# Altium schematic sheet POWER.schdoc
size 521 x 279 mm
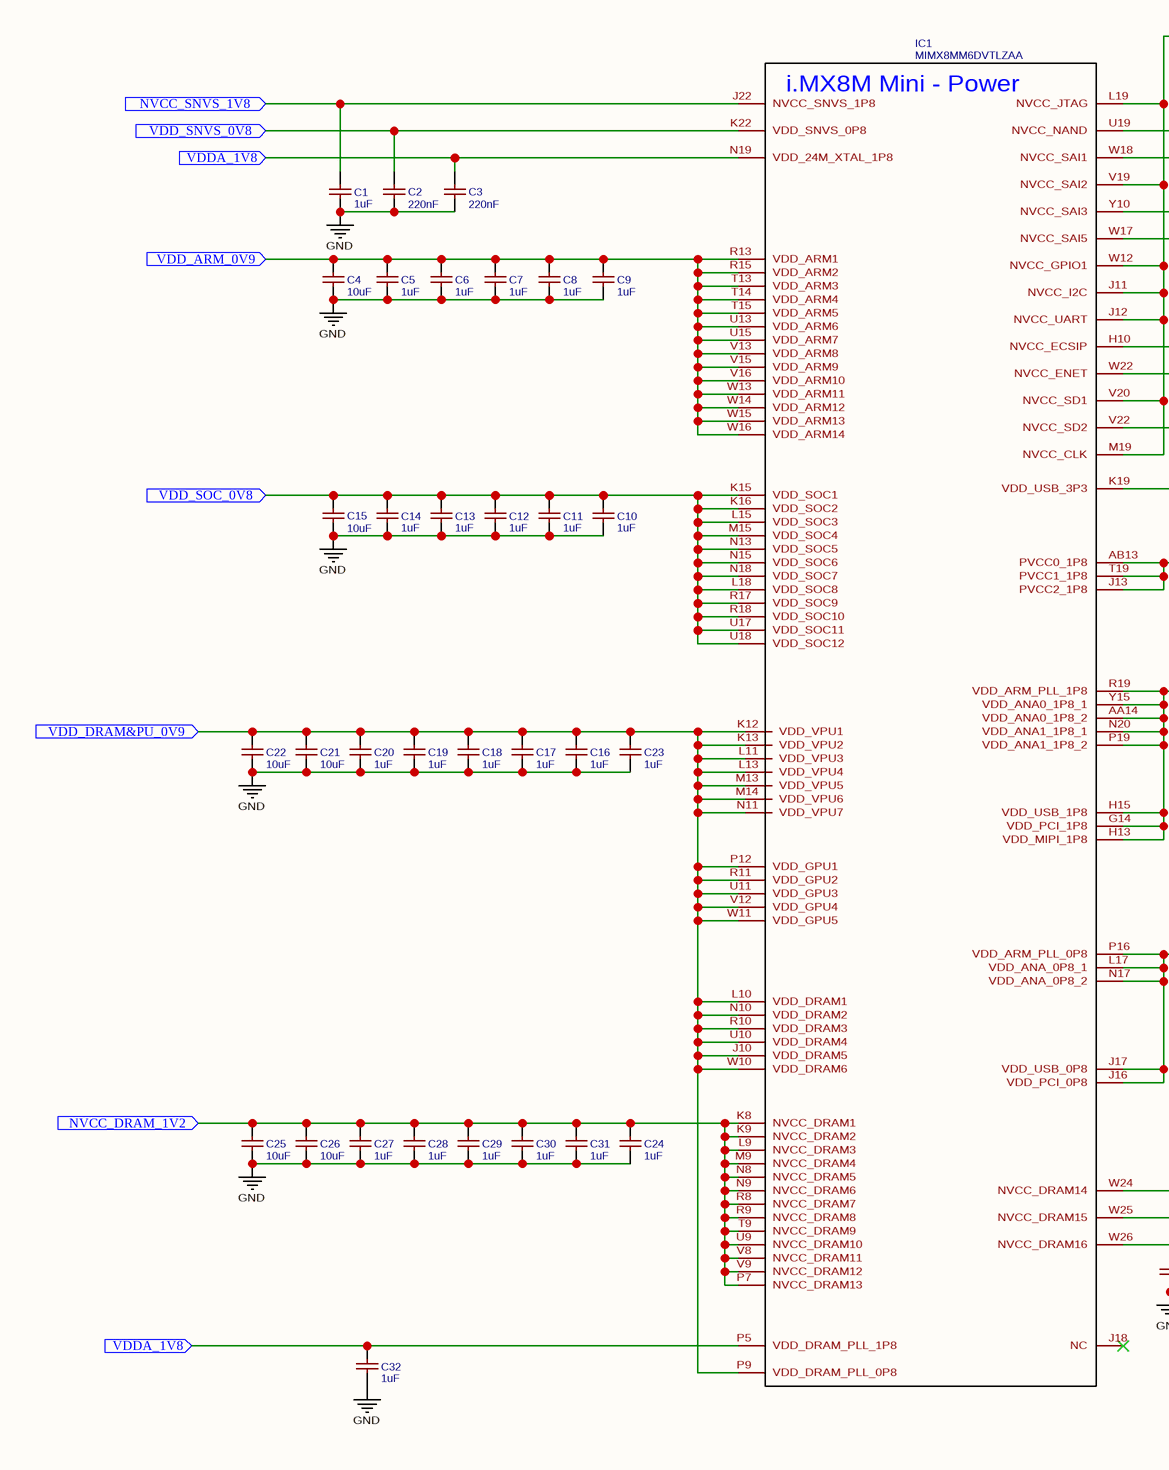
[diagram p0: POWER.schdoc, left]
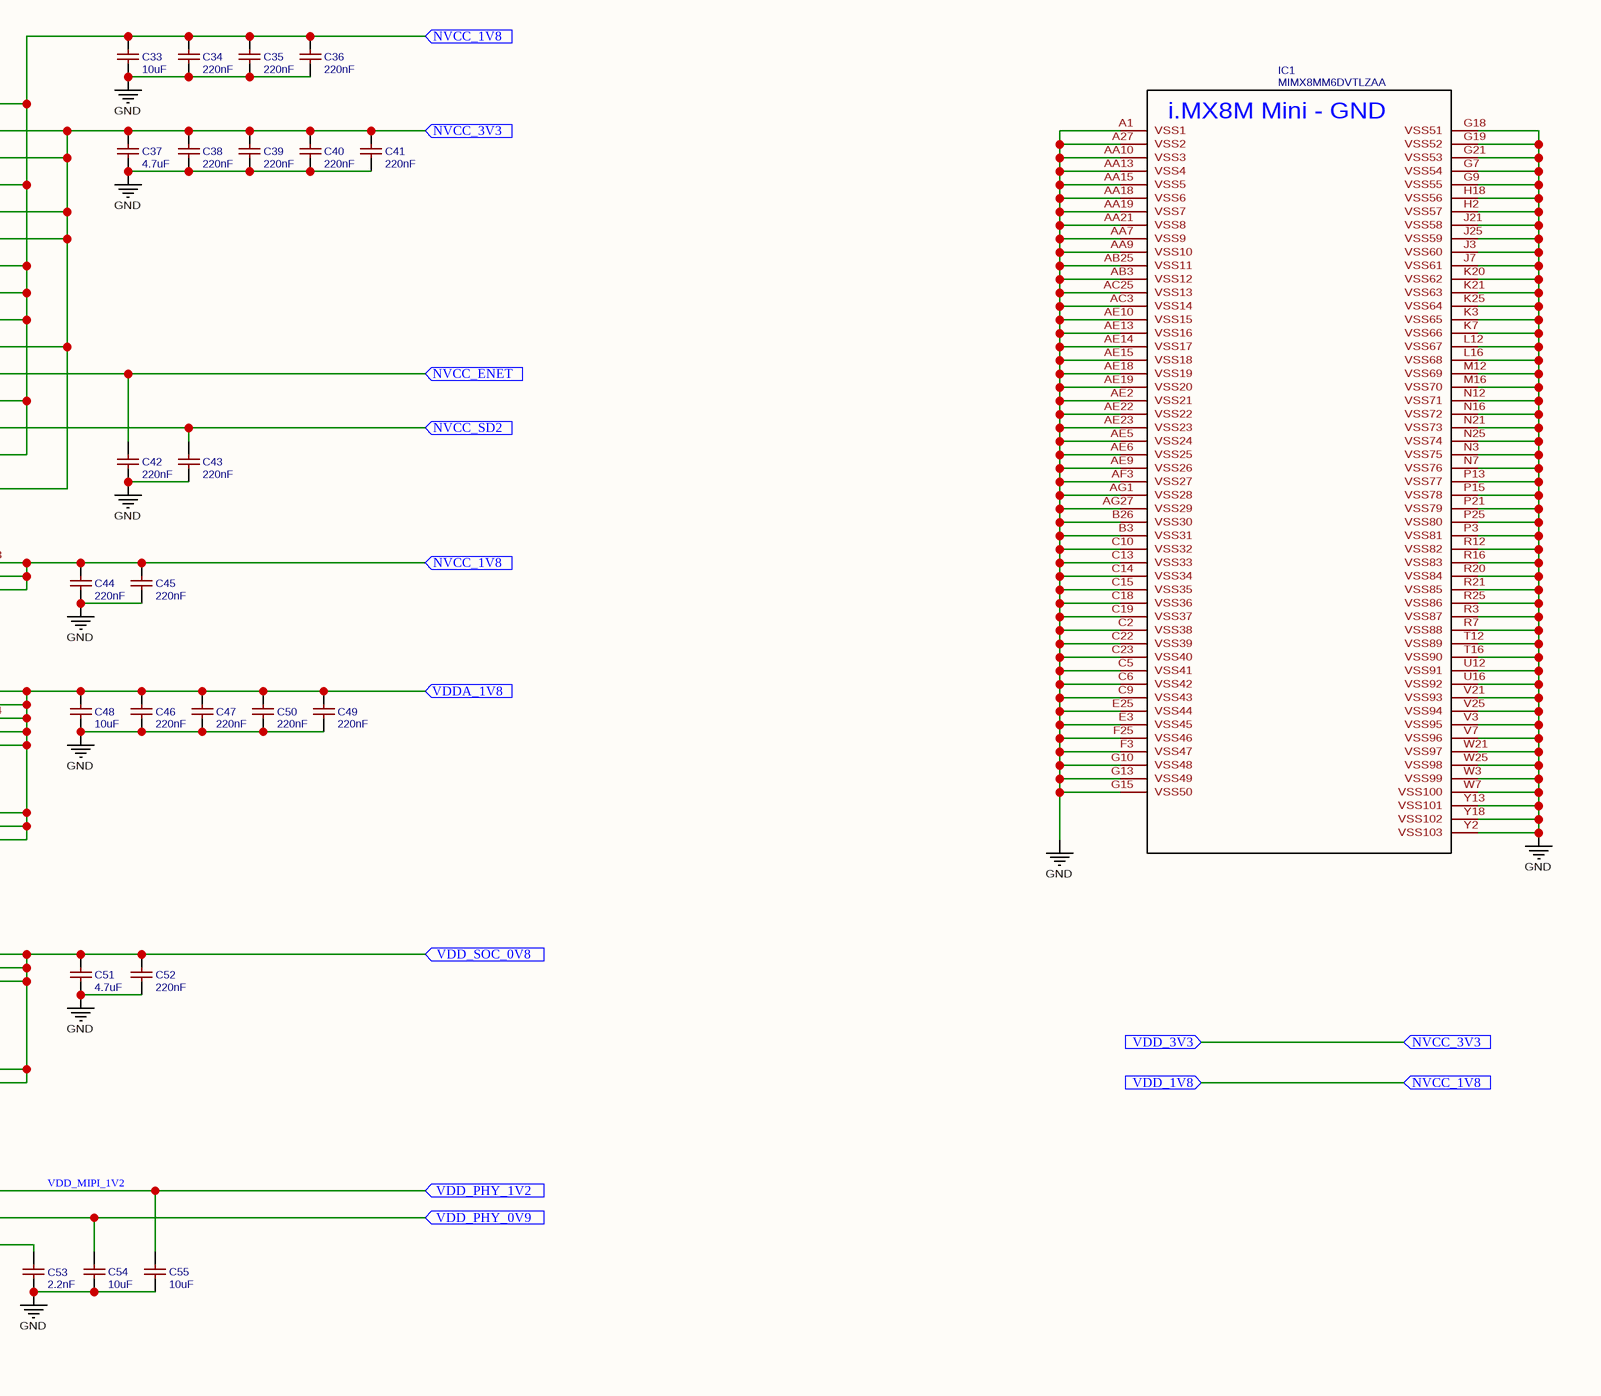
[diagram p1: POWER.schdoc, right]

## Parts
(Parts that share a designator on the sheet are numbered #1, #2 ... from top to bottom, then left to right.)
C1  1uF  [C0603]
C2  220nF  [C0805]
C3  220nF  [C0805]
C4  10uF  [C0402]
C5  1uF  [C0603]
C6  1uF  [C0603]
C7  1uF  [C0603]
C8  1uF  [C0603]
C9  1uF  [C0603]
C10  1uF  [C0603]
C11  1uF  [C0603]
C12  1uF  [C0603]
C13  1uF  [C0603]
C14  1uF  [C0603]
C15  10uF  [C0402]
C16  1uF  [C0603]
C17  1uF  [C0603]
C18  1uF  [C0603]
C19  1uF  [C0603]
C20  1uF  [C0603]
C21  10uF  [C0402]
C22  10uF  [C0402]
C23  1uF  [C0603]
C24  1uF  [C0603]
C25  10uF  [C0402]
C26  10uF  [C0402]
C27  1uF  [C0603]
C28  1uF  [C0603]
C29  1uF  [C0603]
C30  1uF  [C0603]
C31  1uF  [C0603]
C32  1uF  [C0603]
C33  10uF  [C0402]
C34  220nF  [C0805]
C35  220nF  [C0805]
C36  220nF  [C0805]
C37  4.7uF  [C0402]
C38  220nF  [C0805]
C39  220nF  [C0805]
C40  220nF  [C0805]
C41  220nF  [C0805]
C42  220nF  [C0805]
C43  220nF  [C0805]
C44  220nF  [C0805]
C45  220nF  [C0805]
C46  220nF  [C0805]
C47  220nF  [C0805]
C48  10uF  [C0402]
C49  220nF  [C0805]
C50  220nF  [C0805]
C51  4.7uF  [C0402]
C52  220nF  [C0805]
C53  2.2nF  [C0402]
C54  10uF  [C0402]
C55  10uF  [C0402]
IC1#1  MIMX8MM6DVTLZAA  [BGA486C50P27X27_1400X1400X125]
IC1#2  MIMX8MM6DVTLZAA  [BGA486C50P27X27_1400X1400X125]

## Ports
NVCC_1V8 (in), NVCC_3V3 (in), NVCC_DRAM_1V2 (in), NVCC_ENET (in), NVCC_SD2 (in), NVCC_SNVS_1V8 (in), VDD_1V8 (in), VDD_3V3 (in), VDD_ARM_0V9 (in), VDD_DRAM&PU_0V9 (in), VDD_PHY_0V9 (in), VDD_PHY_1V2 (in), VDD_SNVS_0V8 (in), VDD_SOC_0V8 (in), VDDA_1V8 (in)

## Nets
GND: C1.1 C2.1 C3.1 C4.1 C5.1 C6.1 C7.1 C8.1 C9.1 C10.1 C11.1 C12.1 C13.1 C14.1 C15.1 C16.1 C17.1 C18.1 C19.1 C20.1 C21.1 C22.1 C23.1 C24.1 C25.1 C26.1 C27.1 C28.1 C29.1 C30.1 C31.1 C32.1 C33.1 C34.1 C35.1 C36.1 C37.1 C38.1 C39.1 C40.1 C41.1 C42.1 C43.1 C44.1 C45.1 C46.1 C47.1 C48.1 C49.1 C50.1 C51.1 C52.1 C53.1 C54.1 C55.1 IC1#2.A1(VSS1) IC1#2.A27(VSS2) IC1#2.AA7(VSS9) IC1#2.AA9(VSS10) IC1#2.AA10(VSS3) IC1#2.AA13(VSS4) IC1#2.AA15(VSS5) IC1#2.AA18(VSS6) IC1#2.AA19(VSS7) IC1#2.AA21(VSS8) IC1#2.AB3(VSS12) IC1#2.AB25(VSS11) IC1#2.AC3(VSS14) IC1#2.AC25(VSS13) IC1#2.AE2(VSS21) IC1#2.AE5(VSS24) IC1#2.AE6(VSS25) IC1#2.AE9(VSS26) IC1#2.AE10(VSS15) IC1#2.AE13(VSS16) IC1#2.AE14(VSS17) IC1#2.AE15(VSS18) IC1#2.AE18(VSS19) IC1#2.AE19(VSS20) IC1#2.AE22(VSS22) IC1#2.AE23(VSS23) IC1#2.AF3(VSS27) IC1#2.AG1(VSS28) IC1#2.AG27(VSS29) IC1#2.B3(VSS31) IC1#2.B26(VSS30) IC1#2.C2(VSS38) IC1#2.C5(VSS41) IC1#2.C6(VSS42) IC1#2.C9(VSS43) IC1#2.C10(VSS32) IC1#2.C13(VSS33) IC1#2.C14(VSS34) IC1#2.C15(VSS35) IC1#2.C18(VSS36) IC1#2.C19(VSS37) IC1#2.C22(VSS39) IC1#2.C23(VSS40) IC1#2.E3(VSS45) IC1#2.E25(VSS44) IC1#2.F3(VSS47) IC1#2.F25(VSS46) IC1#2.G7(VSS54) IC1#2.G9(VSS55) IC1#2.G10(VSS48) IC1#2.G13(VSS49) IC1#2.G15(VSS50) IC1#2.G18(VSS51) IC1#2.G19(VSS52) IC1#2.G21(VSS53) IC1#2.H2(VSS57) IC1#2.H18(VSS56) IC1#2.J3(VSS60) IC1#2.J7(VSS61) IC1#2.J21(VSS58) IC1#2.J25(VSS59) IC1#2.K3(VSS65) IC1#2.K7(VSS66) IC1#2.K20(VSS62) IC1#2.K21(VSS63) IC1#2.K25(VSS64) IC1#2.L12(VSS67) IC1#2.L16(VSS68) IC1#2.M12(VSS69) IC1#2.M16(VSS70) IC1#2.N3(VSS75) IC1#2.N7(VSS76) IC1#2.N12(VSS71) IC1#2.N16(VSS72) IC1#2.N21(VSS73) IC1#2.N25(VSS74) IC1#2.P3(VSS81) IC1#2.P13(VSS77) IC1#2.P15(VSS78) IC1#2.P21(VSS79) IC1#2.P25(VSS80) IC1#2.R3(VSS87) IC1#2.R7(VSS88) IC1#2.R12(VSS82) IC1#2.R16(VSS83) IC1#2.R20(VSS84) IC1#2.R21(VSS85) IC1#2.R25(VSS86) IC1#2.T12(VSS89) IC1#2.T16(VSS90) IC1#2.U12(VSS91) IC1#2.U16(VSS92) IC1#2.V3(VSS95) IC1#2.V7(VSS96) IC1#2.V21(VSS93) IC1#2.V25(VSS94) IC1#2.W3(VSS99) IC1#2.W7(VSS100) IC1#2.W21(VSS97) IC1#2.W25(VSS98) IC1#2.Y2(VSS103) IC1#2.Y13(VSS101) IC1#2.Y18(VSS102)
NVCC_1V8: C33.2 C34.2 C35.2 C36.2 C44.2 C45.2 IC1#1.AB13(PVCC0_1P8) IC1#1.J11(NVCC_I2C) IC1#1.J12(NVCC_UART) IC1#1.J13(PVCC2_1P8) IC1#1.L19(NVCC_JTAG) IC1#1.M19(NVCC_CLK) IC1#1.T19(PVCC1_1P8) IC1#1.V19(NVCC_SAI2) IC1#1.V20(NVCC_SD1) IC1#1.W12(NVCC_GPIO1) ; port NVCC_1V8, port VDD_1V8
NVCC_3V3: C37.2 C38.2 C39.2 C40.2 C41.2 IC1#1.H10(NVCC_ECSIP) IC1#1.K19(VDD_USB_3P3) IC1#1.U19(NVCC_NAND) IC1#1.W17(NVCC_SAI5) IC1#1.W18(NVCC_SAI1) IC1#1.Y10(NVCC_SAI3) ; port VDD_3V3, port NVCC_3V3
NVCC_DRAM_1V2: C24.2 C25.2 C26.2 C27.2 C28.2 C29.2 C30.2 C31.2 IC1#1.K8(NVCC_DRAM1) IC1#1.K9(NVCC_DRAM2) IC1#1.L9(NVCC_DRAM3) IC1#1.M9(NVCC_DRAM4) IC1#1.N8(NVCC_DRAM5) IC1#1.N9(NVCC_DRAM6) IC1#1.P7(NVCC_DRAM13) IC1#1.R8(NVCC_DRAM7) IC1#1.R9(NVCC_DRAM8) IC1#1.T9(NVCC_DRAM9) IC1#1.U9(NVCC_DRAM10) IC1#1.V8(NVCC_DRAM11) IC1#1.V9(NVCC_DRAM12) ; port NVCC_DRAM_1V2
NVCC_ENET: C42.2 IC1#1.W22(NVCC_ENET) ; port NVCC_ENET
NVCC_SD2: C43.2 IC1#1.V22(NVCC_SD2) ; port NVCC_SD2
NVCC_SNVS_1V8: C1.2 IC1#1.J22(NVCC_SNVS_1P8) ; port NVCC_SNVS_1V8
VDD_ARM_0V9: C4.2 C5.2 C6.2 C7.2 C8.2 C9.2 IC1#1.R13(VDD_ARM1) IC1#1.R15(VDD_ARM2) IC1#1.T13(VDD_ARM3) IC1#1.T14(VDD_ARM4) IC1#1.T15(VDD_ARM5) IC1#1.U13(VDD_ARM6) IC1#1.U15(VDD_ARM7) IC1#1.V13(VDD_ARM8) IC1#1.V15(VDD_ARM9) IC1#1.V16(VDD_ARM10) IC1#1.W13(VDD_ARM11) IC1#1.W14(VDD_ARM12) IC1#1.W15(VDD_ARM13) IC1#1.W16(VDD_ARM14) ; port VDD_ARM_0V9
VDD_DRAM&PU_0V9: C16.2 C17.2 C18.2 C19.2 C20.2 C21.2 C22.2 C23.2 IC1#1.J10(VDD_DRAM5) IC1#1.K12(VDD_VPU1) IC1#1.K13(VDD_VPU2) IC1#1.L10(VDD_DRAM1) IC1#1.L11(VDD_VPU3) IC1#1.L13(VDD_VPU4) IC1#1.M13(VDD_VPU5) IC1#1.M14(VDD_VPU6) IC1#1.N10(VDD_DRAM2) IC1#1.N11(VDD_VPU7) IC1#1.P9(VDD_DRAM_PLL_0P8) IC1#1.P12(VDD_GPU1) IC1#1.R10(VDD_DRAM3) IC1#1.R11(VDD_GPU2) IC1#1.U10(VDD_DRAM4) IC1#1.U11(VDD_GPU3) IC1#1.V12(VDD_GPU4) IC1#1.W10(VDD_DRAM6) IC1#1.W11(VDD_GPU5) ; port VDD_DRAM&PU_0V9
VDD_MIPI_1V2: C55.2 IC1#1.W24(NVCC_DRAM14) ; port VDD_PHY_1V2
VDD_PHY_0V9: C54.2 IC1#1.W25(NVCC_DRAM15) ; port VDD_PHY_0V9
VDD_SNVS_0V8: C2.2 IC1#1.K22(VDD_SNVS_0P8) ; port VDD_SNVS_0V8
VDD_SOC_0V8: C10.2 C11.2 C12.2 C13.2 C14.2 C15.2 C51.2 C52.2 IC1#1.J16(VDD_PCI_0P8) IC1#1.J17(VDD_USB_0P8) IC1#1.K15(VDD_SOC1) IC1#1.K16(VDD_SOC2) IC1#1.L15(VDD_SOC3) IC1#1.L17(VDD_ANA_0P8_1) IC1#1.L18(VDD_SOC8) IC1#1.M15(VDD_SOC4) IC1#1.N13(VDD_SOC5) IC1#1.N15(VDD_SOC6) IC1#1.N17(VDD_ANA_0P8_2) IC1#1.N18(VDD_SOC7) IC1#1.P16(VDD_ARM_PLL_0P8) IC1#1.R17(VDD_SOC9) IC1#1.R18(VDD_SOC10) IC1#1.U17(VDD_SOC11) IC1#1.U18(VDD_SOC12) ; port VDD_SOC_0V8
VDDA_1V8: C3.2 C32.2 C46.2 C47.2 C48.2 C49.2 C50.2 IC1#1.AA14(VDD_ANA0_1P8_2) IC1#1.G14(VDD_PCI_1P8) IC1#1.H13(VDD_MIPI_1P8) IC1#1.H15(VDD_USB_1P8) IC1#1.N19(VDD_24M_XTAL_1P8) IC1#1.N20(VDD_ANA1_1P8_1) IC1#1.P5(VDD_DRAM_PLL_1P8) IC1#1.P19(VDD_ANA1_1P8_2) IC1#1.R19(VDD_ARM_PLL_1P8) IC1#1.Y15(VDD_ANA0_1P8_1) ; port VDDA_1V8
NetC53_2: C53.2 IC1#1.W26(NVCC_DRAM16)

Not connected (* = marked no-connect by the designer): IC1#1 J18(NC)*

## Notes on the sheet
- (in symbol MIMX8MM6DVTLZAA) i.MX8M Mini - GND; i.MX8M Mini - Power

## Library data of the parts
C1 C5-C14 C16-C20 C23 C24 C27-C32 = 1uF: BOM_Manufacturer Part: CL10A105KB8NNNC; BOM_Manufacturer: SAMSUNG; nameAlias: Capacitance; SMT Type: Basic; BOM_Supplier: LCSC; BOM_Supplier Part: C15849; BOM_JLCPCB SMD: Yes; spicePre: C; spiceSymbolName: CL10A105KB8NNNC
C2 C3 C34-C36 C38-C47 C49 C50 C52 = 220nF: BOM_Manufacturer: FH; BOM_Manufacturer Part: 0805F224M500NT; nameAlias: Capacitance; BOM_Supplier: LCSC; BOM_Supplier Part: C41051; spicePre: C; spiceSymbolName: 0805F224M500NT_C41051
C4 C15 C21 C22 C25 C26 C33 C48 C54 C55 = 10uF: BOM_Manufacturer Part: CL05A106MQ5NUNC; BOM_Manufacturer: SAMSUNG; nameAlias: Capacitance; SMT Type: Basic; BOM_Supplier: LCSC; BOM_Supplier Part: C15525; BOM_JLCPCB SMD: Yes; spicePre: C; spiceSymbolName: CL05A106MQ5NUNC
C37 C51 = 4.7uF: BOM_Manufacturer Part: CL05A475MP5NRNC; BOM_Manufacturer: SAMSUNG; nameAlias: Capacitance; SMT Type: Basic; BOM_Supplier: LCSC; BOM_Supplier Part: C23733; BOM_JLCPCB SMD: Yes; spicePre: C; spiceSymbolName: CL05A475MP5NRNC
C53 = 2.2nF: BOM_Manufacturer: FH; BOM_Manufacturer Part: 0402B222K500NT; nameAlias: Capacitance; SMT Type: Basic; BOM_Supplier: LCSC; BOM_Supplier Part: C1531; BOM_JLCPCB SMD: Yes; spicePre: C; spiceSymbolName: 0402B222K500NT
IC1#1 IC1#2 = MIMX8MM6DVTLZAA: subpart_no: 2; Contributor: Ke'Ondrae_Mell; spicePre: I; spiceSymbolName: MIMX8MM6DVTLZAA